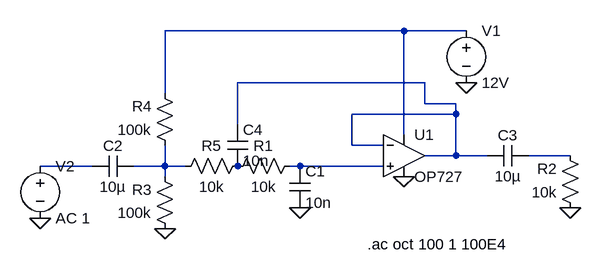
[diagram p0: schematic Sim-passabasso-sallenkey.asc]
Sim-passabasso-sallenkey.asc, the LTspice schematic file:
Version 4
SHEET 1 880 680
WIRE 480 128 112 128
WIRE 576 128 480 128
WIRE 512 208 224 208
WIRE 112 224 112 128
WIRE 512 240 512 208
WIRE 560 240 512 240
WIRE 560 256 560 240
WIRE 560 256 400 256
WIRE 224 272 224 208
WIRE 480 288 480 128
WIRE 400 304 400 256
WIRE 448 304 400 304
WIRE 560 320 560 256
WIRE 560 320 512 320
WIRE 608 320 560 320
WIRE 736 320 672 320
WIRE 0 336 -80 336
WIRE 112 336 112 304
WIRE 112 336 64 336
WIRE 144 336 112 336
WIRE 320 336 304 336
WIRE 448 336 320 336
WIRE 112 352 112 336
FLAG -80 416 0
FLAG 576 208 0
FLAG 480 352 0
FLAG 736 400 0
FLAG 320 400 0
FLAG 112 432 0
SYMBOL Opamps/OP727 480 256 R0
SYMATTR InstName U1
SYMBOL res 320 320 R90
WINDOW 0 0 56 VBottom 2
WINDOW 3 32 56 VTop 2
SYMATTR InstName R1
SYMATTR Value 10k
SYMBOL res 752 416 R180
WINDOW 0 36 76 Left 2
WINDOW 3 36 40 Left 2
SYMATTR InstName R2
SYMATTR Value 10k
SYMBOL res 128 448 R180
WINDOW 0 36 76 Left 2
WINDOW 3 36 40 Left 2
SYMATTR InstName R3
SYMATTR Value 100k
SYMBOL res 128 320 R180
WINDOW 0 36 76 Left 2
WINDOW 3 36 40 Left 2
SYMATTR InstName R4
SYMATTR Value 100k
SYMBOL cap 304 336 R0
SYMATTR InstName C1
SYMATTR Value 10n
SYMBOL cap 64 320 R90
WINDOW 0 0 32 VBottom 2
WINDOW 3 32 32 VTop 2
SYMATTR InstName C2
SYMATTR Value 10µ
SYMBOL cap 672 304 R90
WINDOW 0 0 32 VBottom 2
WINDOW 3 32 32 VTop 2
SYMATTR InstName C3
SYMATTR Value 10µ
SYMBOL voltage 576 112 R0
SYMATTR InstName V1
SYMATTR Value 12V
SYMBOL voltage -80 320 R0
SYMATTR InstName V2
SYMATTR Value AC 1
SYMBOL res 240 320 R90
WINDOW 0 0 56 VBottom 2
WINDOW 3 32 56 VTop 2
SYMATTR InstName R5
SYMATTR Value 10k
SYMBOL cap 208 272 R0
SYMATTR InstName C4
SYMATTR Value 10n
TEXT 424 456 Left 2 !.ac oct 100 1 100E4

The netlist it stands for:
* Sim-passabasso-sallenkey.asc
XU1 N006 N002 N001 0 N002 OP727  ; pins In+ In- V+ V- OUT
R1 N006 P001 10k
R2 0 N003 10k
R3 0 N005 100k
R4 N005 N001 100k
C1 N006 0 10n
C2 N005 N004 10µ
C3 N003 N002 10µ
V1 N001 0 12V
V2 N004 0 AC 1
R5 P001 N005 10k
C4 N002 P001 10n
.ac oct 100 1 100E4
.backanno
.end